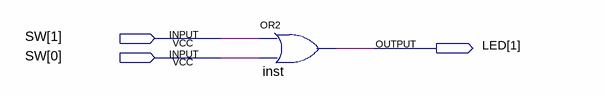
[diagram p0: schematic sheet]
// Quartus schematic lab1ex1.bdf as structural Verilog: 1 symbols, 3 pins
module lab1ex1 (
  input  [1:0] SW,
  output [1:1] LED
);

  or inst (LED[1], SW[1], SW[0]);
endmodule
